# EAGLE design PCB-ACM (EAGLE 7.7.0)
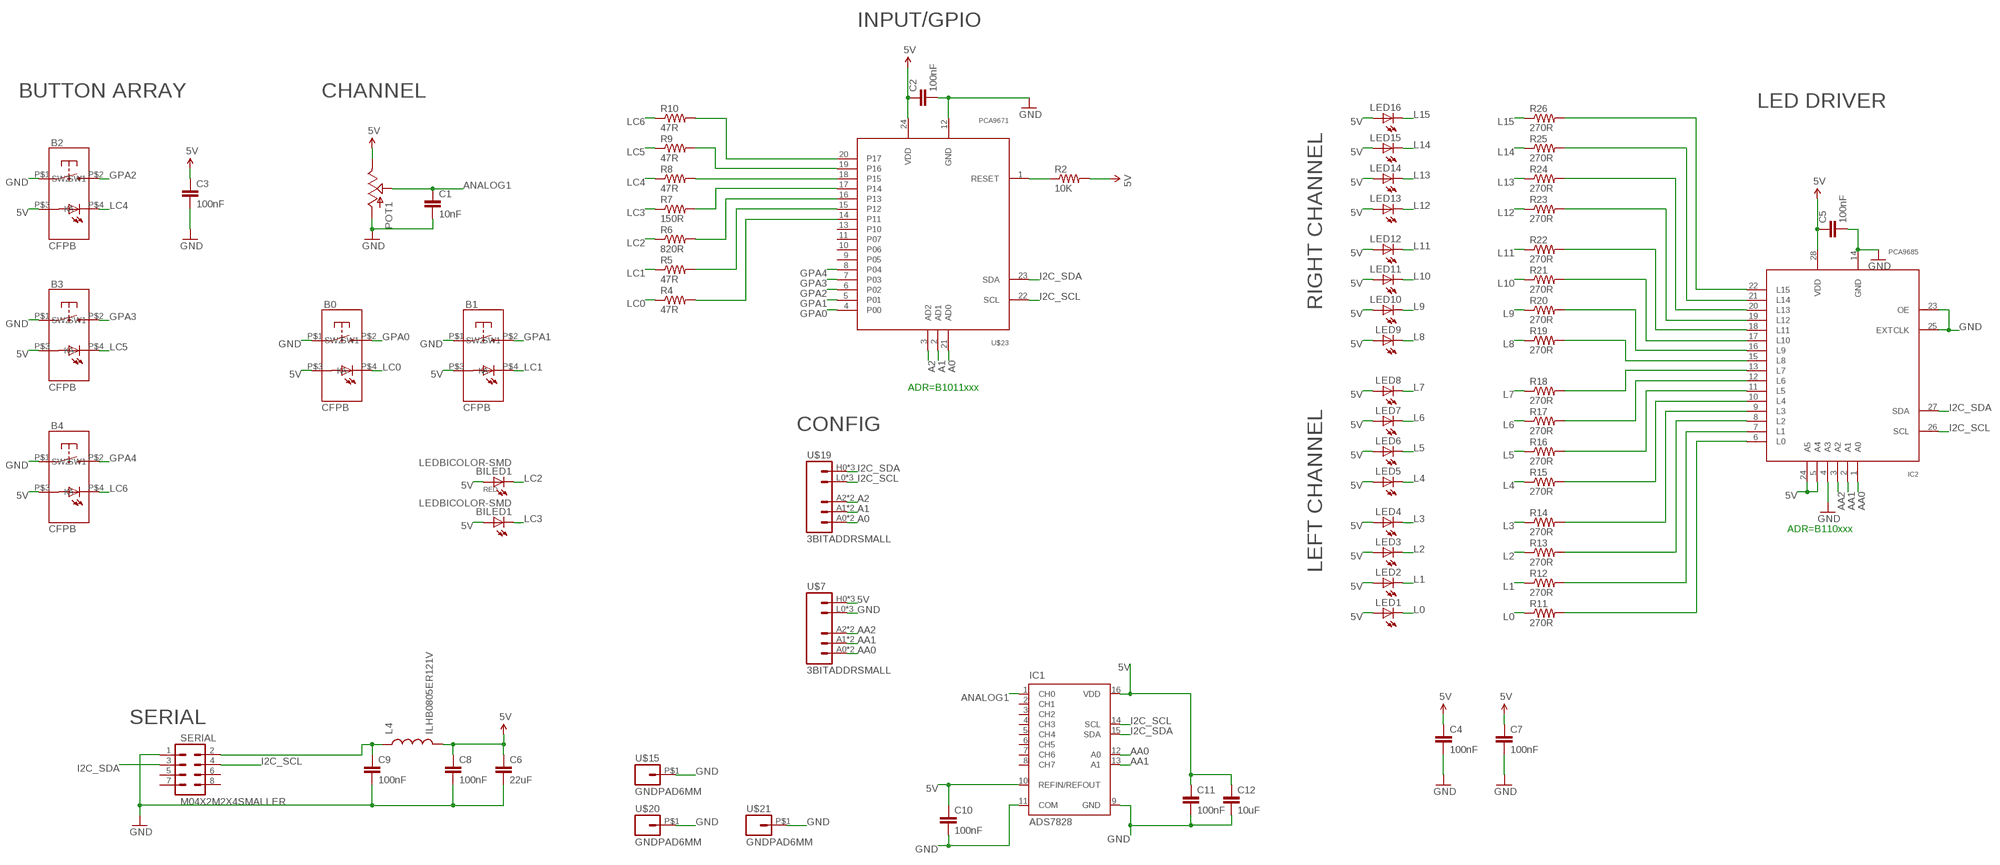
[diagram p0: schematic, sheet 1]

## Parts
B0  CFPB  [CFPB-6/9MM]
B1  CFPB  [CFPB-6/9MM]
B2  CFPB  [CFPB-6/9MM]
B3  CFPB  [CFPB-6/9MM]
B4  CFPB  [CFPB-6/9MM]
BILED1  LEDBICOLOR-SMD  [LEDBICOLOR-SMD]
C1  10nF  CAP0603-CAP  [0603-CAP]
C2  100nF  CAP0603-CAP  [0603-CAP]
C3  100nF  CAP0603-CAP  [0603-CAP]
C4  100nF  CAP0603-CAP  [0603-CAP]
C5  100nF  CAP0603-CAP  [0603-CAP]
C6  22uF  CAP0805  [0805]
C7  100nF  CAP0603-CAP  [0603-CAP]
C8  100nF  CAP0603-CAP  [0603-CAP]
C9  100nF  CAP0603-CAP  [0603-CAP]
C10  100nF  CAP0603-CAP  [0603-CAP]
C11  100nF  CAP0603-CAP  [0603-CAP]
C12  10uF  CAP0805  [0805]
IC1  ADS7828  [TSSOP16-PW]
IC2  PCA9685  [TSSOP28]
L4  ILHB0805ER121V  INDUCTOR0805  [0805]
LED1  LED3MM  [LED3MM]
LED2  LED3MM  [LED3MM]
LED3  LED3MM  [LED3MM]
LED4  LED3MM  [LED3MM]
LED5  LED3MM  [LED3MM]
LED6  LED3MM  [LED3MM]
LED7  LED3MM  [LED3MM]
LED8  LED3MM  [LED3MM]
LED9  LED3MM  [LED3MM]
LED10  LED3MM  [LED3MM]
LED11  LED3MM  [LED3MM]
LED12  LED3MM  [LED3MM]
LED13  LED3MM  [LED3MM]
LED14  LED3MM  [LED3MM]
LED15  LED3MM  [LED3MM]
LED16  LED3MM  [LED3MM]
POT1  POT  [ALPS_POT]
R2  10K  RESISTOR0603-RES  [0603-RES]
R4  47R  RESISTOR0603-RES  [0603-RES]
R5  47R  RESISTOR0603-RES  [0603-RES]
R6  820R  RESISTOR0603-RES  [0603-RES]
R7  150R  RESISTOR0603-RES  [0603-RES]
R8  47R  RESISTOR0603-RES  [0603-RES]
R9  47R  RESISTOR0603-RES  [0603-RES]
R10  47R  RESISTOR0603-RES  [0603-RES]
R11  270R  RESISTOR0603-RES  [0603-RES]
R12  270R  RESISTOR0603-RES  [0603-RES]
R13  270R  RESISTOR0603-RES  [0603-RES]
R14  270R  RESISTOR0603-RES  [0603-RES]
R15  270R  RESISTOR0603-RES  [0603-RES]
R16  270R  RESISTOR0603-RES  [0603-RES]
R17  270R  RESISTOR0603-RES  [0603-RES]
R18  270R  RESISTOR0603-RES  [0603-RES]
R19  270R  RESISTOR0603-RES  [0603-RES]
R20  270R  RESISTOR0603-RES  [0603-RES]
R21  270R  RESISTOR0603-RES  [0603-RES]
R22  270R  RESISTOR0603-RES  [0603-RES]
R23  270R  RESISTOR0603-RES  [0603-RES]
R24  270R  RESISTOR0603-RES  [0603-RES]
R25  270R  RESISTOR0603-RES  [0603-RES]
R26  270R  RESISTOR0603-RES  [0603-RES]
SERIAL  M04X2M2X4SMALLER  [M2X4SMALLER]
U$7  3BITADDRSMALL  [3BITADDR_SMALL]
U$15  GNDPAD6MM  [3.2MMPAD6MM]
U$19  3BITADDRSMALL  [3BITADDR_SMALL]
U$20  GNDPAD6MM  [3.2MMPAD6MM]
U$21  GNDPAD6MM  [3.2MMPAD6MM]
U$23  PCA9671  [TSSOP24]

## Nets
5V [Power]: B0.P$3(A) B1.P$3(A) B2.P$3(A) B3.P$3(A) B4.P$3(A) BILED1.P$1(A) BILED1.P$3(A1) C2.1 C3.1 C4.1 C5.1 C6.1 C7.1 C8.1 C10.1 C11.1 C12.1 IC1.10(REFIN/REFOUT) IC1.16(VDD) IC2.5(A4) IC2.24(A5) IC2.28(VDD) L4.2 LED1.A LED2.A LED3.A LED4.A LED5.A LED6.A LED7.A LED8.A LED9.A LED10.A LED11.A LED12.A LED13.A LED14.A LED15.A LED16.A POT1.P$1(E) R2.2 U$7.H0(VCC) U$7.H1(VCC) U$7.H2(VCC) U$23.24(VDD)
A0: U$19.A0 U$19.AS0(A0) U$23.21(AD0)
A1: U$19.A1 U$19.AS1(A1) U$23.2(AD1)
A2: U$19.A2 U$19.AS2(A2) U$23.3(AD2)
AA0: IC1.12(A0) IC2.1(A0) U$7.A0 U$7.AS0(A0)
AA1: IC1.13(A1) IC2.2(A1) U$7.A1 U$7.AS1(A1)
AA2: IC2.3(A2) U$7.A2 U$7.AS2(A2)
ANALOG1: C1.1 IC1.1(CH0) POT1.P$2(S)
ARD_5V [Power]: C9.1 L4.1 SERIAL.2
GND [Power]: B0.P$1(SW1) B1.P$1(SW1) B2.P$1(SW1) B3.P$1(SW1) B4.P$1(SW1) C1.2 C2.2 C3.2 C4.2 C5.2 C6.2 C7.2 C8.2 C9.2 C10.2 C11.2 C12.2 IC1.9(GND) IC1.11(COM) IC2.4(A3) IC2.14(GND) IC2.23(OE) IC2.25(EXTCLK) POT1.P$3(A) SERIAL.1 U$7.L0(GND) U$7.L1(GND) U$7.L2(GND) U$15.P$1 U$20.P$1 U$21.P$1 U$23.12(GND)
GPA0 [Signal]: B0.P$2(SW2) U$23.4(P00)
GPA1 [Signal]: B1.P$2(SW2) U$23.5(P01)
GPA2 [Signal]: B2.P$2(SW2) U$23.6(P02)
GPA3 [Signal]: B3.P$2(SW2) U$23.7(P03)
GPA4 [Signal]: B4.P$2(SW2) U$23.8(P04)
I2C_SCL: IC1.14(SCL) IC2.26(SCL) SERIAL.4 U$19.L0(GND) U$19.L1(GND) U$19.L2(GND) U$23.22(SCL)
I2C_SDA: IC1.15(SDA) IC2.27(SDA) SERIAL.3 U$19.H0(VCC) U$19.H1(VCC) U$19.H2(VCC) U$23.23(SDA)
L0: LED1.K(C) R11.1
L1: LED2.K(C) R12.1
L2: LED3.K(C) R13.1
L3: LED4.K(C) R14.1
L4: LED5.K(C) R15.1
L5: LED6.K(C) R16.1
L6: LED7.K(C) R17.1
L7: LED8.K(C) R18.1
L8: LED9.K(C) R19.1
L9: LED10.K(C) R20.1
L10: LED11.K(C) R21.1
L11: LED12.K(C) R22.1
L12: LED13.K(C) R23.1
L13: LED14.K(C) R24.1
L14: LED15.K(C) R25.1
L15: LED16.K(C) R26.1
LC0: B0.P$4(K) R4.1
LC1: B1.P$4(K) R5.1
LC2: BILED1.P$2(C) R6.1
LC3: BILED1.P$4(C1) R7.1
LC4: B2.P$4(K) R8.1
LC5: B3.P$4(K) R9.1
LC6: B4.P$4(K) R10.1
N$1: IC2.13(L7) R18.2
N$2: R7.2 U$23.17(P14)
N$3: R8.2 U$23.18(P15)
N$4: R9.2 U$23.19(P16)
N$5: R10.2 U$23.20(P17)
N$6: R2.1 U$23.1(RESET)
N$7: R6.2 U$23.16(P13)
N$8: R5.2 U$23.15(P12)
N$9: R4.2 U$23.14(P11)
N$16: IC2.12(L6) R17.2
N$17: IC2.11(L5) R16.2
N$18: IC2.10(L4) R15.2
N$19: IC2.9(L3) R14.2
N$20: IC2.8(L2) R13.2
N$21: IC2.7(L1) R12.2
N$22: IC2.6(L0) R11.2
N$23: IC2.15(L8) R19.2
N$24: IC2.16(L9) R20.2
N$25: IC2.17(L10) R21.2
N$26: IC2.18(L11) R22.2
N$27: IC2.19(L12) R23.2
N$28: IC2.20(L13) R24.2
N$29: IC2.21(L14) R25.2
N$30: IC2.22(L15) R26.2
Unconnected: IC1.2(CH1) IC1.3(CH2) IC1.4(CH3) IC1.5(CH4) IC1.6(CH5) IC1.7(CH6) IC1.8(CH7) SERIAL.5 SERIAL.6 SERIAL.7 SERIAL.8 U$23.9(P05) U$23.10(P06) U$23.11(P07) U$23.13(P10)

## Notes on the sheet
- INPUT/GPIO
- BUTTON ARRAY | CHANNEL
- LED DRIVER
- RIGHT CHANNEL
- ADR=B1011xxx
- CONFIG
- ADR=B110xxx
- LEFT CHANNEL
- SERIAL

## Library data of the parts
B0 B1-B4 = SKAARHOJ:CFPB
BILED1 = SKAARHOJ:LEDBICOLOR-SMD
C1-C12 = SparkFun:CAP: Capacitor Standard 0603 ceramic capacitor, and 0.1" leaded capacitor.
IC1 = burr-brown:ADS7828: 12-Bit, 8-Channel Sampling ANALOG-TO-DIGITAL CONVERTER with I2C? Interface Source: www.ti.com .. ADS7828.pdf; MF: TEXAS INSTRUMENTS; MPN: ADS7828E/250; OC_FARNELL: 1470338; OC_NEWARK: 74C7158
IC2 = wsmith:PCA9685
L4 = SparkFun:INDUCTOR: Inductors Basic Inductor/Choke - 0603 and 1206. Footprints are not proven and vary greatly between part numbers.
LED1-LED16 = SparkFun:LED: LEDs Standard schematic elements and footprints for 5mm, 3mm, 1206, and 0603 sized LEDs. 5mm - Spark Fun Electronics SKU : COM-00529 (and others)
POT1 = SparkFun:POT
R2 R4-R26 = SparkFun:RESISTOR: Resistor Basic schematic elements and footprints for 0603, 1206, and PTH resistors.
SERIAL = SKAARHOJ:M04X2
U$7 U$19 = SKAARHOJ:3BITADDR
U$15 U$20 U$21 = SKAARHOJ:GNDPAD
U$23 = SKAARHOJ:PCA9671

## Net classes
0 default: width 0.203 mm, drill 0.406 mm, clearance 0.152 mm
1 Power: width 0.406 mm, drill 0.61 mm, clearance 0.203 mm
2 Signal: width 0.152 mm, clearance 0.152 mm

## Board
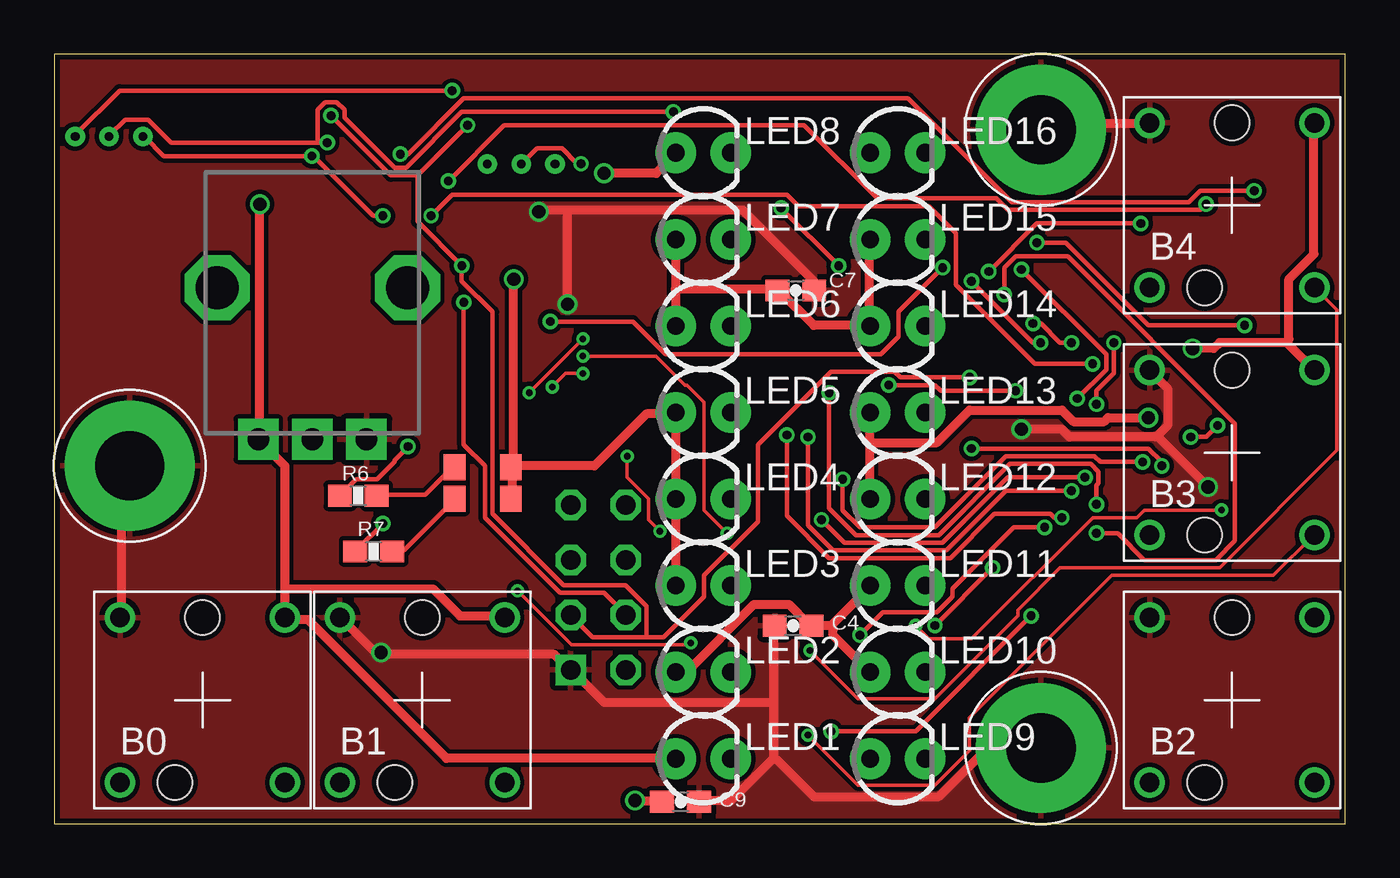
[diagram p1: board, top side]
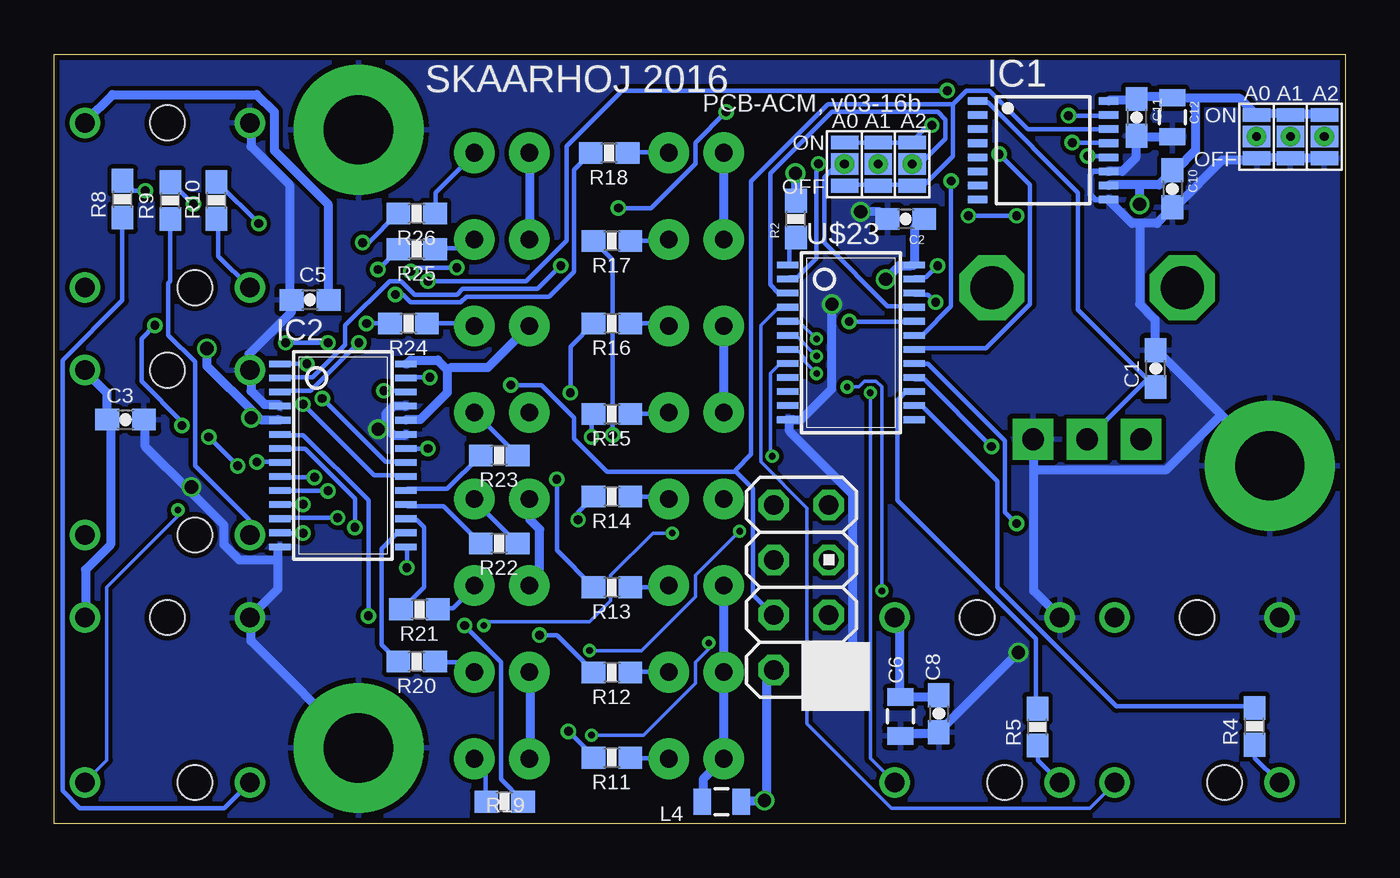
[diagram p2: board, bottom side, seen from below]

Size 59.69 x 35.56 mm. Coordinates in mm from the lower left corner, seen from the top.
Outline: 0,0 59.69,0 59.69,35.56 0,35.56 0,0
Copper layers (1*16): Top 0.035mm / dielectric 1.5mm / Bottom 0.035mm
Design rules "Fusion_eagle_rule_v1.1": minimum track width 6mil, minimum drill 12mil, track to track 6mil, track to pad 6mil, pad to pad 6mil, via to via 6mil, smd to smd 0mil, copper to edge 10mil, drill to drill 10mil, minimum pad ring 10mil, minimum via ring 6mil, stop-mask expansion 2mil, vias tented up to drill 100mil, thermal gap 10mil

### Footprints (pad centres in the part's own frame; a part is rotated, then mirrored left to right if it is on the bottom)
CFPB-6/9MM = drill 0.9: P$1 -3.81,3.81; P$2 3.81,-3.81; P$3 3.81,3.81; P$4 -3.81,-3.81 | hole 1.6: 0,3.81; -1.27,-3.81
LEDBICOLOR-SMD = smd 1 x 1.2: P$1 1.3,0.725; P$2 -1.3,0.725; P$3 1.3,-0.725; P$4 -1.3,-0.725
0603-CAP = smd 1.1 x 1: 1 -0.85,0; 2 0.85,0
0805 = smd 0.8 x 1.2: 1 -0.9,0; 2 0.9,0
TSSOP16-PW = smd 0.35 x 0.9: 1 -2.275,-3.025; 2 -1.625,-3.025; 3 -0.975,-3.025; 4 -0.325,-3.025; 5 0.325,-3.025; 6 0.975,-3.025; 7 1.625,-3.025; 8 2.275,-3.025; 9 2.275,3.025; 10 1.625,3.025; 11 0.975,3.025; 12 0.325,3.025; 13 -0.325,3.025; 14 -0.975,3.025; 15 -1.625,3.025; 16 -2.275,3.025
TSSOP28 = smd 0.305 x 0.991: 1 -4.225,-2.918; 2 -3.575,-2.918; 3 -2.925,-2.918; 4 -2.275,-2.918; 5 -1.625,-2.918; 6 -0.975,-2.918; 7 -0.325,-2.918; 8 0.325,-2.918; 9 0.975,-2.918; 10 1.625,-2.918; 11 2.275,-2.918; 12 2.925,-2.918; 13 3.575,-2.918; 14 4.225,-2.918; 15 4.225,2.918; 16 3.575,2.918; 17 2.925,2.918; 18 2.275,2.918; 19 1.625,2.918; 20 0.975,2.918; 21 0.325,2.918; 22 -0.325,2.918; 23 -0.975,2.918; 24 -1.625,2.918; 25 -2.275,2.918; 26 -2.925,2.918; 27 -3.575,2.918; 28 -4.225,2.918
LED3MM = drill 0.813 pad 1.88: A -1.27,0; K 1.27,0
ALPS_POT = drill 1 pad 1.88 square: P$1 7,-2.5; P$2 7,0; P$3 7,2.5 | drill 2 octagon: P$4 0,-4.4; P$5 0,4.4
0603-RES = smd 1.1 x 1: 1 -0.85,0; 2 0.85,0
M2X4SMALLER = drill 0.9 square: 1 -1.27,3.81 | drill 0.9 octagon: 2 1.27,3.81; 3 -1.27,1.27; 4 1.27,1.27; 5 -1.27,-1.27; 6 1.27,-1.27; 7 -1.27,-3.81; 8 1.27,-3.81
3BITADDR_SMALL = drill 0.4: A0 -1.565,0; A1 0,0; A2 1.565,0 | smd 1.27 x 1: AS0 -1.565,0; AS1 0,0; AS2 1.565,0 | smd 1.27 x 0.635: H0 -1.565,1; H1 0,1; H2 1.565,1; L0 -1.565,-1; L1 0,-1; L2 1.565,-1
3.2MMPAD6MM = drill 3.2 pad 6: P$1 0,0
TSSOP24 = smd 0.305 x 0.991: 1 -4.225,-2.918; 2 -3.575,-2.918; 3 -2.925,-2.918; 4 -2.275,-2.918; 5 -1.625,-2.918; 6 -0.975,-2.918; 7 -0.325,-2.918; 8 0.325,-2.918; 9 0.975,-2.918; 10 1.625,-2.918; 11 2.275,-2.918; 12 2.925,-2.918; 13 2.925,2.918; 14 2.275,2.918; 15 1.625,2.918; 16 0.975,2.918; 17 0.325,2.918; 18 -0.325,2.918; 19 -0.975,2.918; 20 -1.625,2.918; 21 -2.275,2.918; 22 -2.925,2.918; 23 -3.575,2.918; 24 -4.225,2.918

### Placement (x,y rotation side)
B0  6.86,5.71 0 top
B1  17.02,5.71 0 top
B2  54.45,5.71 0 top
B3  54.45,17.14 0 top
B4  54.45,28.57 0 top
BILED1  19.81,15.75 0 top
C1  8.77,21.03 90 bottom
C2  20.32,27.94 180 bottom
C3  56.39,18.67 0 bottom
C4  34.16,9.14 180 top
C5  47.85,24.2 180 bottom
C6  20.57,4.95 270 bottom
C7  34.29,24.64 0 top
C8  18.8,5.08 270 bottom
C9  28.96,1.02 0 top
C10  8,29.34 270 bottom
C11  9.65,32.64 270 bottom
C12  8,32.64 270 bottom
IC1  13.97,31.11 270 bottom
IC2  46.34,17.02 270 bottom
L4  28.83,1.02 180 bottom
LED1  30,3 0 top
LED2  30,7 0 top
LED3  30,11 0 top
LED4  30,15 0 top
LED5  30,19 0 top
LED6  30,23 0 top
LED7  30,27 0 top
LED8  30,31 0 top
LED9  39,3 0 top
LED10  39,7 0 top
LED11  39,11 0 top
LED12  39,15 0 top
LED13  39,19 0 top
LED14  39,23 0 top
LED15  39,27 0 top
LED16  39,31 0 top
POT1  11.94,24.77 270 top
R2  25.4,27.94 90 bottom
R4  4.2,4.5 90 bottom
R5  14.23,4.47 90 bottom
R6  14.06,15.15 180 top
R7  14.77,12.58 180 top
R8  56.52,28.86 90 bottom
R9  54.31,28.79 90 bottom
R10  52.18,28.8 90 bottom
R11  33.91,3.05 180 bottom
R12  33.91,6.99 180 bottom
R13  33.91,10.92 180 bottom
R14  33.91,15.11 180 bottom
R15  33.91,18.92 180 bottom
R16  33.91,23.11 180 bottom
R17  33.91,26.92 180 bottom
R18  34.04,30.99 180 bottom
R19  38.86,1.02 0 bottom
R20  42.93,7.49 180 bottom
R21  42.8,9.91 180 bottom
R22  39.12,12.95 180 bottom
R23  39.12,17.02 180 bottom
R24  43.31,23.11 180 bottom
R25  42.93,26.54 180 bottom
R26  42.93,28.19 180 bottom
SERIAL  25.15,10.92 180 bottom
U$7  2.54,31.75 0 bottom
U$15  3.5,16.54 0 top
U$19  21.59,30.48 0 bottom
U$20  45.62,32.06 0 top
U$21  45.62,3.5 0 top
U$23  22.86,21.59 270 bottom

### Tracks (layer width: path | path; a pad name or v marks a point on that pad's centre or on a via)
5V  (via drill 0.61)
  Top 0.406: 10.67,10.85 10.67,16.54 9.51,17.69 POT1.P$1 9.51,17.96 v9.51,28.63 | 10.67,10.85 B0.P$3 10.85,9.42 11.73,9.42 18.14,3.02 28.71,3.02 LED1.A | 10.67,10.85 17.51,10.85 18.76,9.6 20.8,9.6 B1.P$3 | v52.63,21.96 53.61,21.96 53.87,22.23 56.98,22.23 | 56.98,22.23 58.23,20.98 B3.P$3 | B4.P$3 58.23,32.36 58.23,26.31 57.07,25.16 57.07,22.4 56.98,22.23 | 37.69,17.6 37.69,18.94 LED13.A | 37.69,17.6 37.69,15.02 LED12.A | 35.92,9.16 35.03,9.16 C4.1 34.85,9.25 33.96,10.13 32.36,10.13 29.25,7.02 28.8,7.02 LED2.A | 35.92,9.16 37.69,10.94 LED11.A | 35.92,9.16 36.01,8.98 36.01,8.71 37.69,7.02 LED10.A | LED15.A 37.69,26.94 37.69,23.2 LED14.A 37.69,23.02 35.12,23.02 33.52,24.62 C7.1 33.25,24.71 28.71,24.71 | v25.43,30.05 27.83,30.05 28.71,30.94 LED8.A | 28.71,24.71 28.71,26.94 LED7.A | 28.71,24.71 28.71,23.02 LED6.A | BILED1.P$3 21.16,15.02 21.16,16.45 BILED1.P$1 | BILED1.P$1 21.34,16.54 24.98,16.54 27.38,18.94 28.71,18.94 LED5.A 28.71,18.76 28.71,15.02 LED4.A 28.71,14.85 28.71,11.02 LED3.A | v21.25,25.16 21.25,16.71 BILED1.P$1 | v50.58,18.76 48.72,18.76 48.54,18.58 47.12,18.58 46.58,19.11 42.32,19.11 40.8,17.6 37.69,17.6
  Bottom 0.406: 9.51,29.52 8.62,29.52 8,30.14 C10.1 7.82,30.23 6.93,31.11 6.93,33.52 | 9.51,29.52 10.94,29.52 IC1.10 | IC1.16 10.94,33.43 9.69,33.43 C11.1 9.51,33.6 8,33.6 C12.1 7.82,33.52 6.93,33.52 | U$7.H2 0.98,32.8 2.49,32.8 U$7.H1 2.67,32.8 4.09,32.8 U$7.H0 4.27,32.89 4.89,33.52 6.93,33.52 | C8.1 18.85,5.87 20.54,5.87 C6.1 20.62,6.04 20.62,9.34 20.8,9.51 B1.P$3 | v9.51,28.63 9.51,29.52 | C5.1 47.03,24.27 47.03,28.63 49.52,31.11 49.52,32.89 50.32,33.69 56.98,33.69 58.23,32.45 B4.P$3 | 50.45,18.98 52.63,21.16 v52.63,21.96 | 50.45,18.98 50.14,18.67 49.34,18.67 IC2.5 | B3.P$3 58.23,20.89 57.25,19.91 57.25,18.67 C3.1 57.07,18.58 57.07,12.89 58.23,11.73 58.23,9.6 B2.P$3 | LED9.A 37.69,3.02 37.69,6.93 LED10.A | LED12.A 37.69,14.94 37.69,14.05 37.25,13.6 37.25,11.47 37.69,11.02 LED11.A | 41.52,20.98 41.52,19.91 42.76,18.67 43.38,18.67 IC2.24 | 41.52,20.98 41.96,21.43 43.2,21.43 43.38,21.25 IC2.28 | 41.52,20.98 41.34,21.07 39.65,21.07 37.78,22.94 LED14.A | LED16.A 37.69,30.94 37.69,27.03 LED15.A | v25.43,30.05 25.43,28.8 R2.2 | LED8.A 28.71,30.94 28.71,27.03 LED7.A | L4.2 29.69,1.07 29.69,2.04 28.8,2.93 LED1.A 28.71,3.2 28.71,6.93 LED2.A 28.71,7.2 28.71,10.94 LED3.A | C2.1 19.56,27.91 19.91,27.56 19.91,25.87 U$23.24 20.09,25.78 20.62,25.78 v21.25,25.16 | LED6.A 28.71,22.94 28.71,19.02 LED5.A | v50.58,18.76 50.58,18.85 50.45,18.98
A0
  Bottom 0.203: U$23.21 20,23.91 21.16,23.91 24.09,26.85 24.09,29.87 23.56,30.4 23.2,30.4 U$19.AS0 23.2,30.49
A1  (via drill 0.41)
  Top 0.203: v24.36,30.49 24.18,30.49 23.47,31.2 22.31,31.2 U$19.A1
  Bottom 0.203: v24.36,30.49 24.45,30.4 24.45,26.14 25.34,25.25 25.69,25.25 U$23.2 | 21.6,30.49 U$19.A1
A2
  Bottom 0.203: U$23.3 25.78,24.54 26.23,24.54 26.58,24.89 26.58,30.05 23.74,32.89 18.85,32.89 18.49,32.54 18.49,31.65 19.65,30.49 20,30.49 U$19.A2 20.09,30.49
AA0  (via drill 0.41)
  Top 0.203: U$7.A0 4.18,31.74 5.07,30.85 v11.91,30.85 12,30.85 14.76,28.09 v15.2,28.09 | v48.01,21.25 45.34,21.25 41.69,24.89 41.69,27.29 40.45,28.54 34.4,28.54 33.87,29.07 18.4,29.07 v17.42,28.09
  Bottom 0.203: v11.91,30.85 11.02,30.85 IC1.12 | v48.01,21.25 IC2.1 | v15.2,28.09 v17.42,28.09 | 4.18,31.74 U$7.A0
AA1  (via drill 0.41)
  Top 0.203: 12.18,31.47 5.42,31.47 4.36,32.54 3.29,32.54 2.58,31.83 U$7.A1 | 12.18,31.47 v12.62,31.47 | v33.6,28.45 v36.27,25.78 | v28.63,32.89 18.85,32.89 16.27,30.32 15.73,30.32 13.42,32.63 13.42,32.98 13.07,33.34 12.54,33.34 12.18,32.98 12.18,31.47
  Bottom 0.203: v12.62,31.47 11.02,31.47 IC1.13 | v36.27,25.78 37.34,24.71 40.8,24.71 41.07,24.45 43.03,24.45 43.65,25.07 44.18,25.07 46.23,23.02 46.23,22.14 47.74,20.62 49.25,20.62 IC2.2 | v33.6,28.45 32.09,28.45 30.05,30.49 30.05,31.47 v28.63,32.89 | 2.58,31.74 U$7.A1
AA2  (via drill 0.41)
  Top 0.203: v45.61,22.23 45.25,22.23 v42.41,25.07 | v18.4,33.87 3.02,33.87 0.98,31.83 U$7.A2
  Bottom 0.203: v45.61,22.23 47.83,20 49.25,20 IC2.3 | v42.41,25.07 37.87,25.07 36.01,26.94 36.01,31.29 33.43,33.87 v18.4,33.87 | 0.98,31.74 U$7.A2
ANALOG1
  Bottom 0.203: 9.16,20.54 8.8,20.18 C1.1 9.16,20.54 | 9.16,20.54 12.36,23.74 12.36,29.16 16.54,33.34 16.98,33.34 IC1.1 | 9.16,20.54 11.91,17.78 POT1.P$2
ARD_5V  (via drill 0.61)
  Top 0.406: v26.85,1.07 28.09,1.07 C9.1
  Bottom 0.406: L4.1 27.91,1.07 v26.85,1.07 26.76,1.25 26.76,6.84 26.49,7.11 SERIAL.2
GND  (via drill 0.61)
  Top 0.406: v44.72,18.22 46.58,18.22 46.94,17.87 50.94,17.87 | 50.94,17.87 51.47,18.4 51.47,20.09 50.67,20.89 B3.P$1 | B4.P$1 50.58,32.36 45.96,32.36 45.7,32.09 U$20.P$1 | v53.34,15.56 51.12,17.78 50.94,17.87 | B0.P$1 3.11,9.6 3.11,16.18 3.47,16.54 U$15.P$1 | B1.P$1 13.25,9.51 14.85,7.91 v15.11,7.91 15.29,7.82 23.11,7.82 23.74,7.2 SERIAL.1 23.91,7.11 25.43,5.6 33.25,5.6 | 23.74,28.36 22.49,28.36 v22.4,28.27 | 23.74,28.36 31.83,28.36 35.12,25.07 35.12,24.71 C7.2 | 33.25,3.02 31.29,1.07 29.87,1.07 C9.2 | 33.25,5.6 33.25,9.07 C4.2 | 33.25,5.6 33.25,3.02 | v23.74,24 23.74,28.36 | U$21.P$1 45.61,3.47 43.12,3.47 40.89,1.25 35.12,1.25 33.43,2.93 33.25,3.02
  Bottom 0.254: IC1.11 11.64,30.14 11.81,29.97 11.81,29.08 11.56,28.83 IC1.9
  Bottom 0.406: IC1.11 10.94,30.14 10.31,30.14 9.69,30.76 9.69,31.74 C11.2 9.51,31.74 C12.2 | 44.36,18.31 44.01,17.96 43.47,17.96 IC2.23 | 44.36,18.31 44.36,18.94 44.01,19.29 43.47,19.29 IC2.25 | IC2.4 49.34,19.38 49.96,19.38 50.58,20 50.58,20.89 B3.P$1 50.67,21.16 50.67,21.69 48.72,23.65 48.72,24.18 C5.2 48.81,24.36 48.81,29.52 50.58,31.29 50.58,32.36 B4.P$1 | v44.72,18.22 44.54,18.22 44.36,18.31 | 49.34,12.18 49.34,10.85 50.58,9.6 B2.P$1 50.58,9.34 50.58,8.45 45.7,3.56 U$21.P$1 | 49.34,12.18 49.34,12.71 IC2.14 | 53.47,15.42 51.83,13.78 51.83,12.89 51.12,12.18 49.34,12.18 | 53.47,15.42 55.47,17.42 55.47,18.67 C3.2 | v53.34,15.56 53.47,15.42 | U$7.L2 2.49,30.76 U$7.L1 2.67,30.76 4.09,30.76 U$7.L0 4.27,30.67 5.69,30.67 7.82,28.54 C10.2 8,28.45 8.71,27.74 9.51,27.74 | 9.51,27.74 9.87,27.74 10.94,28.8 IC1.9 | 9.51,27.74 9.51,24 8.8,23.29 8.8,21.96 C1.2 8.62,21.78 5.73,18.89 | 5.73,18.89 3.47,16.62 U$15.P$1 | C6.2 20.54,4.09 20.45,4.18 18.85,4.18 C8.2 18.67,4.36 v15.11,7.91 | 14.4,16.36 14.4,10.76 13.25,9.6 B1.P$1 | 14.4,16.36 14.4,17.69 POT1.P$3 | v22.4,28.27 21.51,28.27 21.25,28 C2.2 | SERIAL.1 23.82,7.11 22.76,8.18 22.76,15.2 25.69,18.14 25.69,18.58 U$23.12 25.51,18.67 25.16,18.67 23.74,20.09 v23.74,24 | 5.73,18.89 8.27,16.36 14.4,16.36
  pour Top: 0,0 59.69,0 59.69,35.56 0,35.56
  pour Bottom: 0,0 59.69,0 59.69,35.56 0,35.56
GPA0
  Bottom 0.152: U$23.4 25.78,23.82 26.23,23.82 27.03,23.02 27.03,16.71 24.89,14.58 24.89,4.62 20.98,0.71 11.82,0.71 10.67,1.87 B0.P$2
GPA1  (via drill 0.3)
  Top 0.152: v21.96,19.91 v24.45,22.4
  Bottom 0.152: v24.45,22.4 25.25,23.2 25.69,23.2 U$23.5 | v21.96,19.91 21.96,3.02 20.89,1.96 B1.P$2
GPA2  (via drill 0.3)
  Top 0.152: v24.45,21.6 27.83,21.6 29.16,20.27 29.25,20.27 30.05,19.47 30.05,14.49 v31.11,13.42 | v39.83,9.16 40.45,8.53 42.41,8.53 48.01,14.13 50.05,14.13 50.41,14.49 v53.96,14.49
  Bottom 0.152: v24.45,21.6 25.34,22.49 25.69,22.49 U$23.6 | v31.11,13.42 32,13.42 33.96,11.47 33.96,10.31 34.94,9.34 39.65,9.34 v39.83,9.16 | v53.96,14.49 53.96,14.22 57.25,10.94 57.25,2.93 58.23,1.96 B2.P$2
GPA3  (via drill 0.3)
  Top 0.152: v24.45,20.8 23.65,20.8 v23.02,20.18 | v21.43,10.76 23.91,8.27 29.34,8.27 v29.43,8.36 | v34.85,4.09 37.16,1.78 40.72,1.78 42.32,3.38 42.32,4.89 48.9,11.47 56.36,11.47 58.23,13.34 B3.P$2
  Bottom 0.152: v24.45,20.8 24.98,21.34 24.98,21.51 25.34,21.87 25.69,21.87 U$23.7 | v23.02,20.18 22.49,20.18 22.23,20.45 21.69,20.45 21.43,20.18 v21.43,10.76 | v29.43,8.36 29.43,8.09 30.05,7.47 30.05,6.49 32.45,4.09 v34.85,4.09
GPA4  (via drill 0.3)
  Top 0.152: v26.49,16.98 26.49,16 27.47,15.02 27.47,14.05 v28,13.51 | v34.94,8 37.16,5.78 40.72,5.78 44.54,9.6 44.54,9.87 46.49,11.82 53.87,11.82 59.3,17.25 59.3,23.74 58.32,24.71 B4.P$2
  Bottom 0.152: v26.49,16.98 26.58,17.07 26.58,20.8 26.14,21.25 25.78,21.25 U$23.8 | v28,13.51 30.05,11.47 30.05,10.49 32.54,8 v34.94,8
I2C_SCL  (via drill 0.41)
  Top 0.203: v44.45,20 40.98,20 40.72,20.27 v38.58,20.27 | v18.94,24.09 18.94,17.51 19.91,16.54 19.91,14.13 23.38,10.67 25.43,10.67 26.4,9.69 SERIAL.4
  Bottom 0.203: 18.14,33.25 17.51,33.87 16.45,33.87 14.67,32.09 11.02,32.09 IC1.14 | 18.14,33.25 18.14,30.85 19.47,29.52 20,29.52 U$19.L2 20.09,29.52 21.51,29.52 U$19.L1 21.6,29.52 23.11,29.52 U$19.L0 | v44.45,20 43.47,20 IC2.26 | v38.58,20.27 37.16,20.27 35.65,18.76 35.65,17.78 34.14,16.27 28.18,16.27 | 28.18,16.27 27.38,15.47 27.38,10.58 26.49,9.69 SERIAL.4 | v18.94,24.09 19.29,24.45 19.91,24.45 U$23.22 | 18.14,33.25 23.91,33.25 27.47,29.69 27.47,17.07 28.18,16.36 28.18,16.27
I2C_SDA  (via drill 0.41)
  Top 0.203: v12.8,32.72 15.56,29.96 16.8,29.96 | v19.11,32.27 16.8,29.96 | 16.8,29.96 16.8,27.83 v18.85,25.78 18.85,25.07 20.27,23.65 20.27,14.31 23.56,11.02 26.4,11.02 27.38,10.05 27.38,8.62 | v42.32,20.62 39.12,20.62 38.85,20.89 35.92,20.89 32.54,17.51 32.54,13.96 30.05,11.47 30.05,10.49 28.18,8.62 27.38,8.62 | 27.38,8.62 24.89,8.62 23.91,9.6 SERIAL.3
  Bottom 0.203: v12.8,32.72 11.02,32.72 IC1.15 | v19.11,32.27 19.29,32.27 20,31.56 U$19.H2 20.09,31.47 21.51,31.47 U$19.H1 21.69,31.47 23.11,31.47 U$19.H0 | v18.85,25.78 19.38,25.25 19.91,25.25 U$23.23 | v42.32,20.62 43.38,20.62 IC2.27
L0
  Bottom 0.203: R11.1 32.98,3.02 31.29,3.02 LED1.K
L1
  Bottom 0.203: R12.1 32.98,7.02 31.29,7.02 LED2.K
L2
  Bottom 0.203: R13.1 32.98,10.94 31.29,10.94 LED3.K
L3
  Bottom 0.203: R14.1 31.38,15.11 31.29,15.02 LED4.K
L4
  Bottom 0.203: R15.1 32.98,18.94 31.29,18.94 LED5.K
L5
  Bottom 0.203: R16.1 31.38,23.11 31.29,23.02 LED6.K
L6
  Bottom 0.203: R17.1 32.98,26.94 31.29,26.94 LED7.K
L7
  Bottom 0.203: R18.1 33.16,31.03 31.29,31.03 LED8.K
L8
  Bottom 0.203: R19.1 39.74,1.07 39.74,2.49 40.18,2.93 LED9.K
L9
  Bottom 0.203: R20.1 42.05,7.47 40.72,7.47 40.27,7.02 LED10.K
L10
  Bottom 0.203: R21.1 41.87,9.96 41.25,9.96 40.27,10.94 LED11.K
L11
  Bottom 0.203: R22.1 38.32,12.98 40.27,14.94 LED12.K
L12
  Bottom 0.203: R23.1 38.32,17.07 40.18,18.94 LED13.K
L13
  Bottom 0.203: R24.1 40.36,23.11 40.27,23.02 LED14.K
L14
  Bottom 0.203: R25.1 42.05,26.58 40.63,26.58 40.27,26.94 LED15.K
L15
  Bottom 0.203: R26.1 42.05,28.27 42.05,29.16 40.27,30.94 LED16.K
LC0
  Bottom 0.203: R4.1 4.18,3.65 4.18,3.02 3.11,1.96 B0.P$4
LC1
  Bottom 0.203: R5.1 14.22,3.56 14.22,2.93 13.25,1.96 B1.P$4
LC2
  Top 0.203: R6.1 14.94,15.2 17.16,15.2 18.49,16.54 BILED1.P$2
LC3
  Top 0.203: R7.1 15.65,12.62 16.18,12.62 18.49,14.94 BILED1.P$4
LC4
  Bottom 0.203: R8.1 56.54,28 56.54,24.18 59.3,21.43 59.3,1.51 58.5,0.71 51.83,0.71 50.67,1.87 B2.P$4
LC5
  Bottom 0.203: R9.1 54.32,27.91 54.32,25.07 54.41,24.98 54.41,22.58 53.16,21.34 53.16,16.54 50.67,14.05 50.67,13.34 B3.P$4
LC6
  Bottom 0.203: R10.1 52.09,27.91 52.09,26.23 50.67,24.8 B4.P$4
N$1  (via drill 0.41)
  Top 0.203: v48.18,13.42 49.16,13.42 50.41,12.18 53.7,12.18 54.59,13.07 54.59,18.49 46.85,26.23 44.45,26.23 43.92,25.69 v43.92,24.45
  Bottom 0.203: v48.18,13.42 49.25,13.42 IC2.13 | v43.92,24.45 43.56,24.45 43.2,24.09 40.89,24.09 40.63,24.36 36.8,24.36 35.65,25.51 35.65,30.23 34.94,30.94 R18.2
N$2  (via drill 0.41)
  Top 0.203: v15.2,13.87 13.96,12.62 R7.2
  Bottom 0.203: v15.2,13.87 15.73,14.4 15.73,17.69 19.29,21.25 19.91,21.25 U$23.17
N$3  (via drill 0.41)
  Top 0.203: v16,30.94 16.36,30.94 18.94,33.52 39.47,33.52 44.27,28.71 52.45,28.71 52.98,29.25 v55.47,29.25
  Bottom 0.203: v16,30.94 14.58,29.52 14.58,24 16.62,21.96 19.91,21.96 U$23.18 | v55.47,29.25 56.01,29.25 56.45,29.69 R8.2
N$4  (via drill 0.41)
  Top 0.203: v18.22,29.69 20.8,32.27 34.67,32.27 38.05,28.89 43.56,28.89 44.09,28.36 52.98,28.36 v53.25,28.63
  Bottom 0.203: v18.22,29.69 18.22,23.91 19.56,22.58 19.91,22.58 U$23.19 | v53.25,28.63 54.23,29.6 R9.2
N$5  (via drill 0.41)
  Top 0.203: v22.94,23.2 26.76,23.2 28.27,21.69 38.23,21.69 39.03,22.49 39.03,23.65 v41.07,25.69 | v43.2,25.51 45.43,27.74 v50.23,27.74
  Bottom 0.203: v22.94,23.2 20,23.2 U$23.20 | v41.07,25.69 43.03,25.69 v43.2,25.51 | v50.23,27.74 52.09,29.6 R10.2
N$6
  Bottom 0.203: U$23.1 25.69,25.87 25.69,26.76 25.43,27.03 R2.1
N$7  (via drill 0.41)
  Top 0.203: v16.36,17.42 15.73,16.8 15.73,16.71 14.94,15.91 13.96,15.91 13.25,15.2 R6.2
  Bottom 0.203: v16.36,17.42 19.47,20.54 19.91,20.54 U$23.16
N$8
  Bottom 0.203: U$23.15 20,19.91 20.36,19.91 20.71,19.56 20.71,14.94 14.31,8.53 14.31,5.33 R5.2
N$9
  Bottom 0.203: U$23.14 19.91,19.29 19.56,19.29 16.09,15.82 16.09,10.94 10.58,5.42 4.27,5.42 R4.2
N$16  (via drill 0.41)
  Top 0.203: v46.58,14.13 46.23,14.13 46.05,14.31 43.47,14.31 41.43,12.27 35.83,12.27 33.87,14.22 v33.87,17.96
  Bottom 0.203: v46.58,14.13 49.25,14.13 IC2.12 | v33.87,17.96 33.87,26.05 34.67,26.85 R17.2
N$17  (via drill 0.41)
  Top 0.203: v48.18,14.76 48.18,15.65 48.27,15.73 48.27,16.27 47.92,16.62 44.18,16.62 40.89,13.34 37.07,13.34 35.83,14.58 v35.83,19.91
  Bottom 0.203: v48.18,14.76 49.25,14.76 IC2.11 | v35.83,19.91 35.83,22.05 R16.2
N$18  (via drill 0.41)
  Top 0.203: v47.03,15.38 44.01,15.38 41.25,12.62 36.01,12.62 34.85,13.78 v34.85,17.87
  Bottom 0.203: v47.03,15.38 IC2.10 | v34.85,17.87 34.85,18.76 34.76,18.85 R15.2
N$19  (via drill 0.41)
  Top 0.203: v47.65,16 44.09,16 41.07,12.98 36.54,12.98 v35.47,14.05
  Bottom 0.203: v47.65,16 49.25,16 IC2.9 | v35.47,14.05 35.47,14.4 R14.2
N$20  (via drill 0.41)
  Top 0.203: v50.32,16.71 48.36,16.71 48.09,16.98 44.01,16.98 40.72,13.69 37.25,13.69 36.45,14.49 v36.45,15.91
  Bottom 0.203: v50.32,16.71 49.34,16.71 IC2.8 | v36.45,15.91 36.45,12.62 34.76,10.94 R13.2
N$21  (via drill 0.41)
  Top 0.203: v45.78,13.69 44.36,13.69 41.52,10.85 41.52,10.49 40.8,9.78 38.32,9.78 v37.25,8.71
  Bottom 0.203: v45.78,13.69 45.78,15.02 48.09,17.34 IC2.7 | v37.25,8.71 36.45,8.71 34.76,7.02 R12.2
N$22  (via drill 0.41)
  Top 0.203: v45.16,9.6 39.83,4.27 v35.92,4.27
  Bottom 0.203: v45.16,9.6 45.16,14.94 48.18,17.96 49.25,17.96 IC2.6 | v35.92,4.27 34.76,3.11 R11.2
N$23  (via drill 0.41)
  Top 0.203: v40.72,9.16 v43.38,11.82
  Bottom 0.203: v43.38,11.82 43.38,12.71 IC2.15 | v40.72,9.16 39.03,7.47 39.03,2.04 38.05,1.07 R19.2
N$24
  Bottom 0.203: IC2.16 43.47,13.42 43.83,13.42 44.54,12.71 44.54,8.27 43.83,7.56 R20.2
N$25
  Bottom 0.203: IC2.17 43.38,14.05 42.94,14.05 42.58,13.69 42.58,10.94 43.56,9.96 R21.2
N$26
  Bottom 0.203: IC2.18 43.38,14.67 41.69,14.67 40.01,12.98 R22.2
N$27
  Bottom 0.203: IC2.19 43.38,15.47 41.52,15.47 40.01,16.98 R23.2
N$28  (via drill 0.41)
  Top 0.203: v48.18,19.38 48.18,20 48.98,20.8 v48.98,22.23 | v47.03,22.23 46.49,22.23 45.61,23.11 v45.25,23.11
  Bottom 0.203: v48.18,19.38 44.9,16.09 43.47,16.09 IC2.20 | v47.03,22.23 v48.98,22.23 | R24.2 v45.25,23.11
N$29  (via drill 0.41)
  Top 0.203: v47.3,19.65 48.63,20.98 48.63,21.69 v44.72,25.6
  Bottom 0.203: v47.3,19.65 44.36,16.71 43.47,16.71 IC2.21 | v44.72,25.6 43.83,26.49 R25.2
N$30  (via drill 0.41)
  Top 0.203: v42.41,17.34 50.58,17.34 51.21,16.71 v51.21,16.54 | v52.54,17.87 53.25,17.87 v53.78,18.4 | v55.03,23.02 50.58,23.02 46.76,26.85 v45.43,26.85
  Bottom 0.203: v42.41,17.34 43.38,17.34 IC2.22 | v52.54,17.87 v51.21,16.54 | v53.78,18.4 53.78,18.58 55.65,20.45 55.65,22.4 v55.03,23.02 | v45.43,26.85 45.16,26.85 43.83,28.18 R26.2

### Text on the board
_bsilk: SKAARHOJ 2016 | PCB-ACM, v03-16b